# Altium project Folie_KeyBoard_V100.PrjPcb
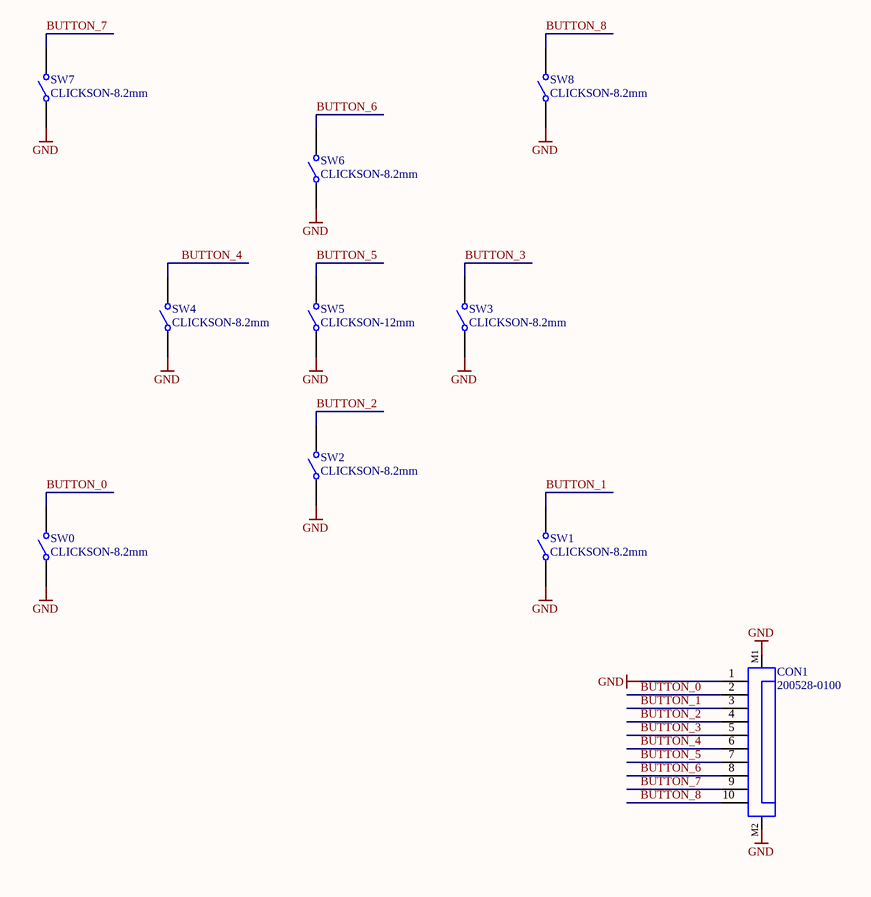
[diagram p0: Folie_KeyBoard_V100_MAIN.SchDoc]
1 sheet, 10 parts. Net scope: global (net labels, ports and power ports of the same name join across sheets).
Board file: Folie_KeyBoard_V100.PcbDoc

## Sheet Folie_KeyBoard_V100_MAIN.SchDoc
size A4 portrait; SheetNumber: 1; SheetTotal: 1

### Parts
CON1  200528-0100  [CON_FPC10_1MM_MOLEX_200528-0100]
SW0  CLICKSON-8.2mm  [CLICKSON-8.2mm]
SW1  CLICKSON-8.2mm  [CLICKSON-8.2mm]
SW2  CLICKSON-8.2mm  [CLICKSON-8.2mm]
SW3  CLICKSON-8.2mm  [CLICKSON-8.2mm]
SW4  CLICKSON-8.2mm  [CLICKSON-8.2mm]
SW5  CLICKSON-12mm  [CLICKSON-12mm]
SW6  CLICKSON-8.2mm  [CLICKSON-8.2mm]
SW7  CLICKSON-8.2mm  [CLICKSON-8.2mm]
SW8  CLICKSON-8.2mm  [CLICKSON-8.2mm]

### Nets
GND: CON1.1 CON1.M1 CON1.M2 SW0.1 SW1.1 SW2.1 SW3.1 SW4.1 SW5.1 SW6.1 SW7.1 SW8.1
BUTTON_0: CON1.2 SW0.2
BUTTON_1: CON1.3 SW1.2
BUTTON_2: CON1.4 SW2.2
BUTTON_3: CON1.5 SW3.2
BUTTON_4: CON1.6 SW4.2
BUTTON_5: CON1.7 SW5.2
BUTTON_6: CON1.8 SW6.2
BUTTON_7: CON1.9 SW7.2
BUTTON_8: CON1.10 SW8.2

### Notes on the sheet
- Board:
- Author:
- Title:
- Project:
- SVN:
- Version:
- Sheet:
- of
- Contact:
- Modified:
- Size:
- A4

### Library data of the parts
CON1 = 228: FFC / FPC Board Connector, 1 mm, 10 Contacts, Receptacle, Easy-On, Surface Mount; Part Number: CON_FPC_MOLEX_200528-0100; Azonosító: 228; Category: Connectors; Subcategory: CONN_Board-to-Wire; Supplier 1: MOUSER; Supplier 1 order number: 538-200528-0100; System: Connector
SW0-SW4 SW6-SW8 = 404: CLICKSON-8.2mm for folie tastature; Azonosító: 404; Part Number: CLICKSON-8.2mm; Category: Electro-mechanicals; Subcategory: ELME_Board Switch
SW5 = 405: CLICKSON-12mm for folie tastature; Azonosító: 405; Part Number: CLICKSON-12mm; Category: Electro-mechanicals; Subcategory: ELME_Board Switch